# EAGLE design RX_Mixer_Balanced_Modulator (EAGLE 5.07)
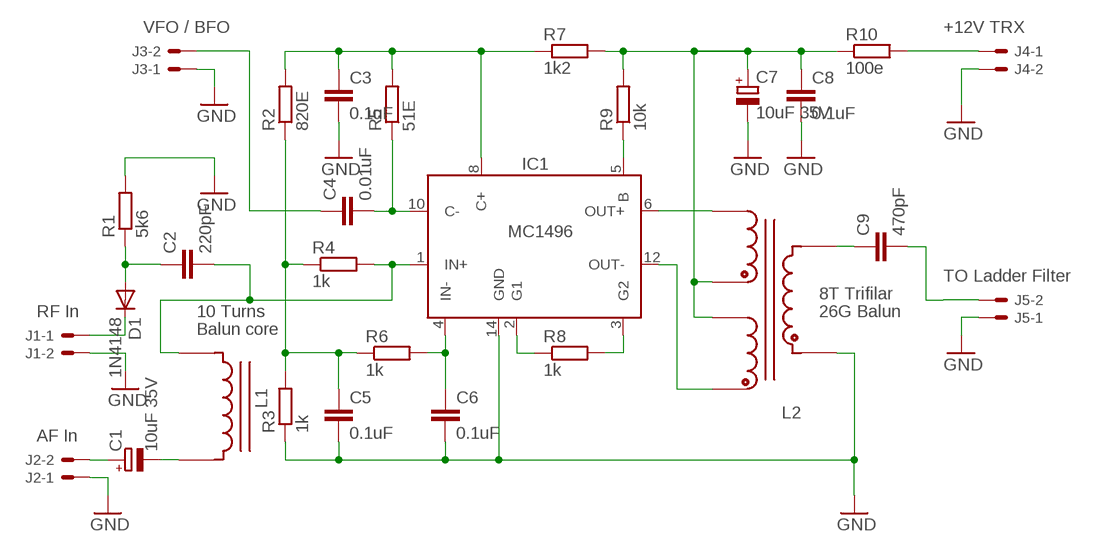
[diagram p0: schematic, sheet 1]

## Parts
C1  10uF 35V  CPOL-EUE2.5-6  [E2,5-6]
C2  220pF  C-EU050-035X075  [C050-035X075]
C3  0.1uF  C-EU050-035X075  [C050-035X075]
C4  0.01uF  C-EU050-035X075  [C050-035X075]
C5  0.1uF  C-EU050-035X075  [C050-035X075]
C6  0.1uF  C-EU050-035X075  [C050-035X075]
C7  10uF 35V  CPOL-EUE2.5-6  [E2,5-6]
C8  0.1uF  C-EU050-035X075  [C050-035X075]
C9  470pF  C-EU050-035X075  [C050-035X075]
D1  1N4148  1N4148DO35-10  [DO35-10]
IC1  MC1496  [MC1496]
J1  22-27-2021-02  [6410-02]
J2  22-27-2021-02  [6410-02]
J3  22-27-2021-02  [6410-02]
J4  22-27-2021-02  [6410-02]
J5  22-27-2021-02  [6410-02]
L1  T37  T37_INDUCTOR  [T37_INDUCTOR]
L2  T50  T50_TRIFILAR_TRANSFORMER  [T50_TRIFILAR_TRANSFORMER]
R1  5k6  R-EU_0207/10  [0207/10]
R2  820E  R-EU_0207/10  [0207/10]
R3  1k  R-EU_0207/10  [0207/10]
R4  1k  R-EU_0207/10  [0207/10]
R5  51E  R-EU_0207/10  [0207/10]
R6  1k  R-EU_0207/10  [0207/10]
R7  1k2  R-EU_0207/10  [0207/10]
R8  1k  R-EU_0207/10  [0207/10]
R9  10k  R-EU_0207/10  [0207/10]
R10  100e  R-EU_0207/10  [0207/10]

## Nets
GND: C3.2 C5.2 C6.2 C7.- C8.2 IC1.14(GND) J1.2 J2.1 J3.1 J4.2 J5.1 L2.C1B R1.2 R3.1
N$1: C2.2 IC1.1(IN+) L1.CA R4.2
N$2: C4.2 IC1.10(C-) R5.1
N$3: C3.1 IC1.8(C+) R2.2 R5.2 R7.1
N$4: C7.+ C8.1 L2.C2A L2.C3B R7.2 R9.2 R10.1
N$5: IC1.5(B) R9.1
N$6: IC1.3(G2) R8.2
N$7: IC1.2(G1) R8.1
N$8: C6.1 IC1.4(IN-) R6.2
N$9: C5.1 R2.1 R3.2 R4.1 R6.1
N$10: C4.1 J3.2
N$11: C9.2 J5.2
N$12: C2.1 D1.A R1.1
N$13: IC1.6(OUT+) L2.C3A
N$14: IC1.12(OUT-) L2.C2B
N$15: C9.1 L2.C1A
N$16: C1.- L1.CB
N$17: J4.1 R10.2
N$18: D1.C J1.1
N$19: C1.+ J2.2

## Notes on the sheet
- VFO / BFO | +12V TRX
- TO Ladder Filter
- 8T Trifilar
- RF In | 10 Turns | 26G Balun
- Balun core
- AF In

## Library data of the parts
C1 C7 = rcl:CPOL-EU: POLARIZED CAPACITOR, European symbol
C2-C6 C8 C9 = rcl:C-EU: CAPACITOR, European symbol
D1 = diode:1N4148: DIODE high speed (Philips)
IC1 = MC1496:MC1496: MC1496
J1-J5 = con-molex:22-?-02: CONNECTOR wire to board 2.54 mm (.1 inch) pitch header
L1 = toroid:T37_INDUCTOR: Inductor wound on a T37 Toroid
L2 = toroid:T50_TRIFILAR_TRANSFORMER: Transformer (having 3 windings) on a T50 Toroid
R1-R10 = rcl:R-EU_: RESISTOR, European symbol

## Board
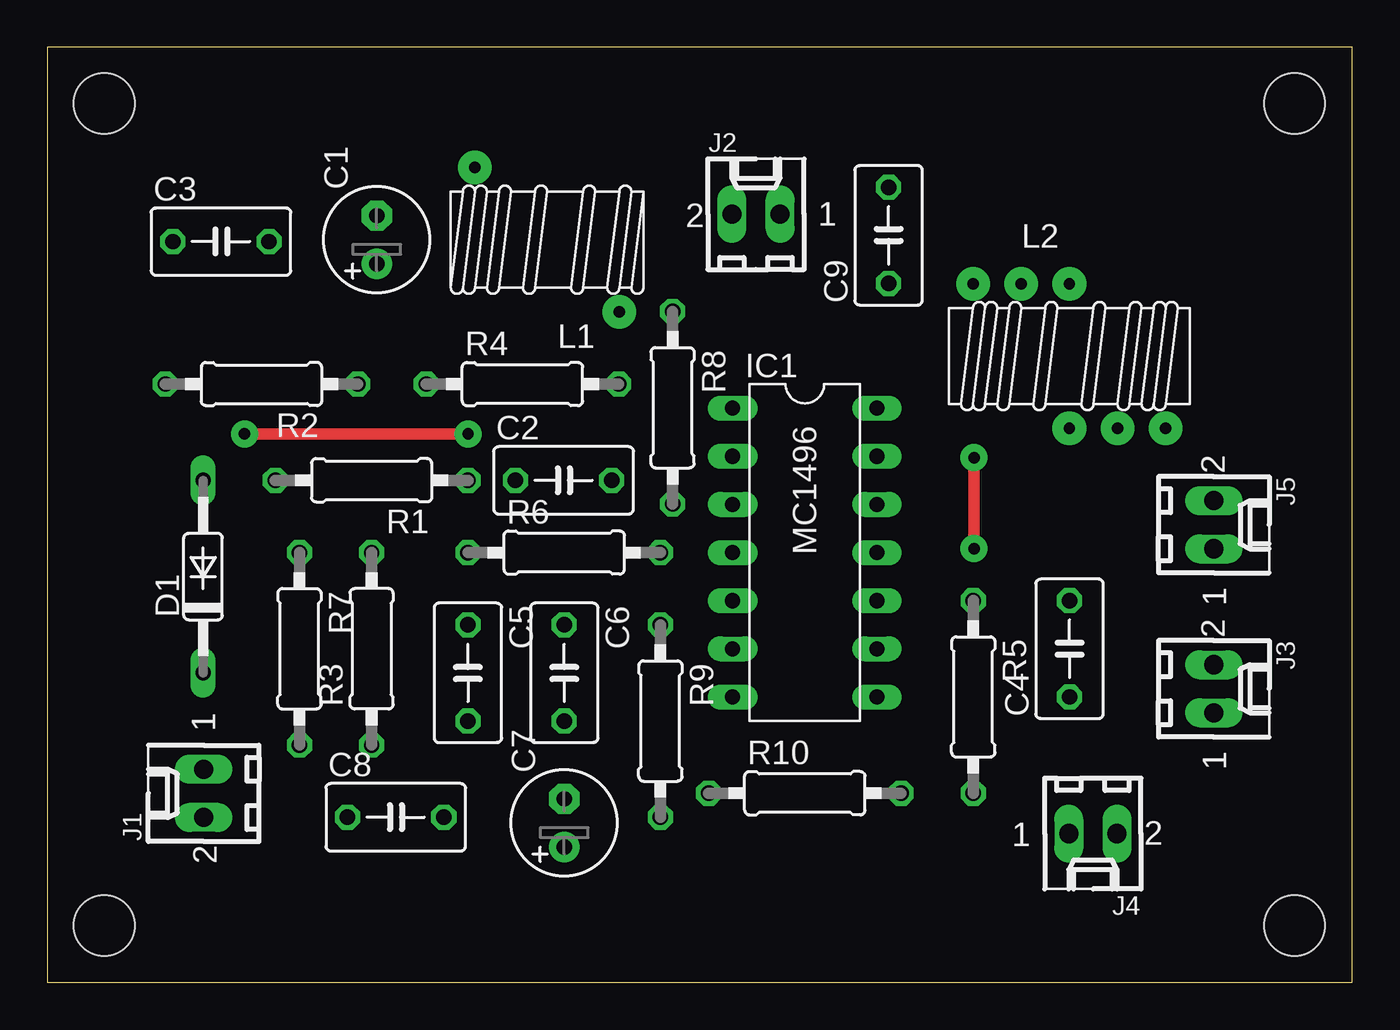
[diagram p1: board, top side]
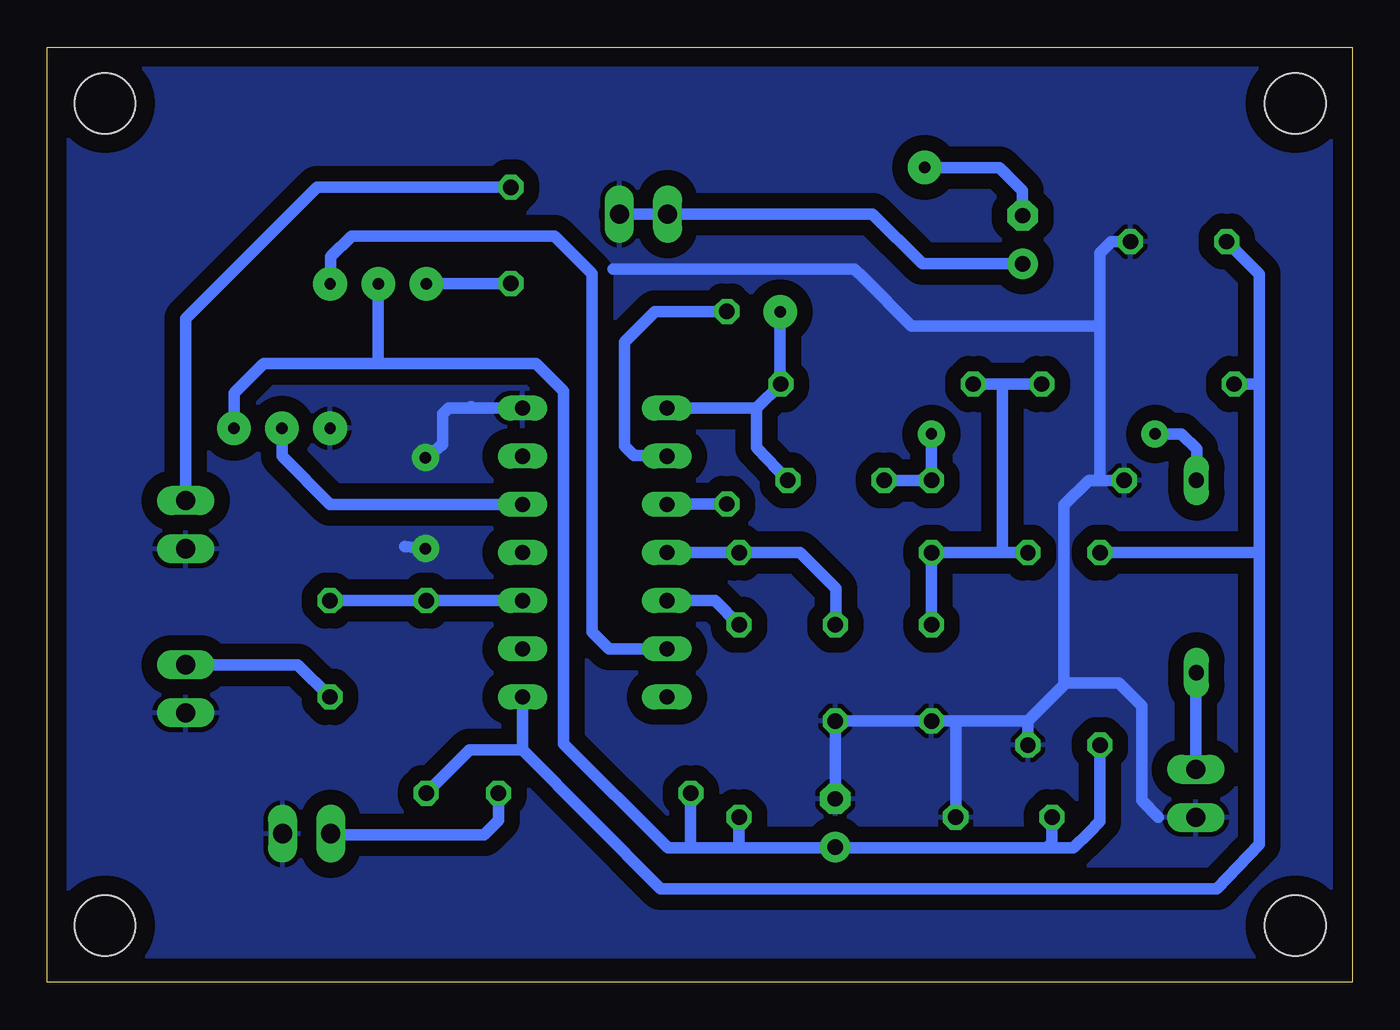
[diagram p2: board, bottom side, seen from below]

Size 68.85 x 49.35 mm. Coordinates in mm from the lower left corner, seen from the top.
Outline: 0,0 68.85,0 68.85,49.35 0,49.35 0,0
Copper layers (1*16): Top 0.035mm / dielectric 1.5mm / Bottom 0.035mm
Design rules "default *": minimum track width 10mil, minimum drill 24mil, track to track 8mil, track to pad 8mil, pad to pad 8mil, via to via 8mil, smd to smd 8mil, copper to edge 40mil, drill to drill 8mil, minimum pad ring 10mil, minimum via ring 8mil, stop-mask expansion 4mil, vias tented up to drill 0mil, thermal gap 10mil
Holes 3.2 mm at 3,46.4 65.8,46.4 3,3 65.8,3

### Footprints (pad centres in the part's own frame; a part is rotated, then mirrored left to right if it is on the bottom)
E2,5-6 = drill 0.813 pad 1.6 round: + -1.27,0 | drill 0.813 pad 1.6 octagon: - 1.27,0
C050-035X075 = drill 0.813 octagon: 1 -2.54,0; 2 2.54,0
DO35-10 = drill 0.813 long: A 5.08,0; C -5.08,0
MC1496 = drill 0.8 long: 1 -7.62,-3.81; 2 -5.08,-3.81; 3 -2.54,-3.81; 4 0,-3.81; 5 2.54,-3.81; 6 5.08,-3.81; 7 7.62,-3.81; 8 7.62,3.81; 9 5.08,3.81; 10 2.54,3.81; 11 0,3.81; 12 -2.54,3.81; 13 -5.08,3.81; 14 -7.62,3.81
6410-02 = drill 1.016 long: 1 1.27,0; 2 -1.27,0
T37_INDUCTOR = drill 0.6 pad 1.778 round: CA -3.81,-3.81; CB 3.81,3.81
T50_TRIFILAR_TRANSFORMER = drill 0.6 pad 1.778 round: C1A -3.81,-5.08; C1B 3.81,0; C2A -3.81,-2.54; C2B 3.81,2.54; C3A -3.81,0; C3B 3.81,5.08
0207/10 = drill 0.813 octagon: 1 -5.08,0; 2 5.08,0

### Placement (x,y rotation side)
C1  17.38,39.2 90 top
C2  27.24,26.5 0 top
C3  9.16,39.1 0 top
C4  53.94,17.61 90 top
C5  22.19,16.34 270 top
C6  27.27,16.34 270 top
C7  27.27,8.42 90 top
C8  18.38,8.72 0 top
C9  44.39,39.43 90 top
D1  8.22,21.42 90 top
IC1  39.97,22.69 270 top
J1  8.25,9.98 90 top
J2  37.39,40.55 0 top
J3  61.55,15.5 270 top
J4  55.17,7.85 180 top
J5  61.55,24.16 270 top
L1  26.37,39.2 90 top
L2  53.93,33.06 270 top
R1  17.11,26.5 180 top
R2  11.3,31.58 180 top
R3  17.11,17.61 90 top
R4  25.07,31.58 0 top
R5  48.86,15.07 270 top
R6  27.27,22.69 0 top
R7  13.3,17.61 270 top
R8  32.99,30.33 270 top
R9  32.35,13.8 270 top
R10  39.97,9.99 0 top

### Tracks (layer width: path | path; a pad name or v marks a point on that pad's centre or on a via)
GND  (via drill 0.6 pad 1.42)
  Top 0.61: v48.9,27.7 v48.9,22.9
  Bottom 0.61: 39,37.65 26.25,37.65 25.8,37.2 23.25,34.65 21.75,34.65 17.85,34.65 17.45,34.65 13.3,34.65 | C7.- C6.2 C5.2 20.9,13.8 | 13.3,26.5 13.9,26.5 15.21,25.2 15.21,24.7 15.21,15.81 15.2,15.8 | 13.3,26.5 R1.2 | 13.3,26.5 13.3,34.65 | C3.2 12.7,39.1 13.3,38.5 13.3,34.65 | 10.22,8.72 11.1,9.6 11.1,14.6 12.3,15.8 15.2,15.8 | 17.1,13.8 20.9,13.8 | 17.1,13.8 17.11,13.79 R3.1 | 17.1,13.8 15.2,15.7 15.2,15.8 | C8.2 20.92,13.78 20.9,13.8 | 46.5,30.4 46.41,30.31 IC1.14 47.69,30.31 48,30 48,28.4 v48.9,27.7 | v48.9,22.9 50,23
  pour Bottom (isolate 0.813): 0.8,49.1 68.6,49.1 68.6,1.4 0.8,1.4
N$1
  Bottom 0.61: 31.42,30.31 IC1.1 | 31.42,30.31 R4.2 30.18,31.61 L1.CA | C2.2 31.42,28.24 31.42,30.31
N$2
  Bottom 0.61: C4.2 R5.1 IC1.10
N$3
  Bottom 0.61: R7.1 8.46,22.69 4.94,22.69 4.9,22.65 | 43.78,12.28 IC1.8 43.85,15 | 43.78,12.28 36.5,4.95 7.15,4.95 4.9,7.3 4.9,22.65 | 4.9,22.65 4.9,24.15 4.9,25.7 4.9,29.75 4.9,31.6 | 4.9,31.6 4.9,37.38 C3.1 | R2.2 4.92,31.58 4.9,31.6 | R5.2 46.57,12.28 43.78,12.28
N$4
  Bottom 0.61: R10.1 34.9,7.1 | 16.1,7.1 15.7,7.1 14.7,7.1 13.9,7.9 13.3,8.5 R7.2 | 16.1,7.1 27.2,7.1 | 27.2,7.1 32.4,7.1 | 32.4,7.1 34.9,7.1 | 34.9,7.1 36.1,7.1 41.6,12.6 41.6,29.6 41.6,31.2 43.05,32.65 50.1,32.65 | C8.1 15.84,7.36 16.1,7.1 | R9.2 32.35,7.15 32.4,7.1 | C7.+ 27.25,7.15 27.2,7.1 | 50.1,32.65 51.4,32.65 | 51.4,32.65 55.55,32.65 57.45,32.65 59,31.1 L2.C3B | 50.1,32.65 50.09,32.66 | L2.C2A 51.39,32.66 51.4,32.65
N$5
  Bottom 0.61: IC1.5 33.62,20.15 R9.1
N$6
  Bottom 0.61: R8.2 36.14,25.25 IC1.3
N$7
  Bottom 0.61: R8.1 36.79,35.41 38.4,33.8 38.4,28.3 37.9,27.8 36.19,27.8 IC1.2
N$8
  Bottom 0.61: IC1.4 R6.2 29.14,22.69 27.25,20.8 27.25,18.9 C6.1
N$9
  Bottom 0.61: R3.2 18.45,22.69 | 18.45,22.69 R6.1 C5.1 | 18.45,31.58 R4.1 18.45,31.58 | 18.45,31.58 R2.1 | 18.45,22.69 18.45,31.58
N$10
  Bottom 0.61: J3.2 55.64,16.77 C4.1
N$11
  Bottom 0.61: J5.2 61.55,35.03 54.61,41.97 C9.2
N$12  (via drill 0.6 pad 1.42)
  Top 0.61: v10.4,28.95 v22.2,28.95
  Bottom 0.61: v10.4,28.95 9,28.95 8.2,28.15 8.2,26.52 D1.A | v22.2,28.95 v22.19,28.94 R1.1 24.6,26.5 C2.1
N$13
  Bottom 0.61: IC1.6 39.21,17.61 40.1,18.5 40.1,32.1 40.1,37.4 42.1,39.4 52.8,39.4 53.9,38.3 53.9,36.9 L2.C3A
N$14
  Bottom 0.61: IC1.12 53.93,25.23 56.47,27.77 L2.C2B
N$15
  Bottom 0.61: C9.1 48.83,36.89 L2.C1A
N$16
  Bottom 0.61: L1.CB 18.61,43.01 17.4,41.8 17.4,40.49 C1.-
N$17
  Bottom 0.61: R10.2 45.05,8.55 45.8,7.8 53.85,7.8 J4.1
N$18
  Bottom 0.406: 8.25,16.34 D1.C
  Bottom 0.61: J1.1 8.25,16.34
N$19
  Bottom 0.61: C1.+ 22.68,37.93 25.3,40.55 38.62,40.55 J2.2